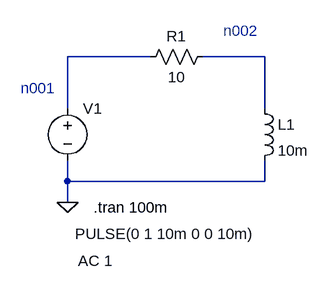
[diagram p0: schematic Yoneda-p70_Coil.asc]
Yoneda-p70_Coil.asc, the LTspice schematic file:
Version 4
SHEET 1 880 680
WIRE 224 32 96 32
WIRE 400 32 304 32
WIRE 96 112 96 32
WIRE 400 112 400 32
WIRE 96 224 96 192
WIRE 400 224 400 192
WIRE 400 224 96 224
WIRE 96 256 96 224
FLAG 96 256 0
SYMBOL voltage 96 96 R0
WINDOW 3 12 209 Left 2
WINDOW 123 16 250 Left 2
WINDOW 39 0 0 Left 2
SYMATTR InstName V1
SYMATTR Value PULSE(0 1 10m 0 0 10m)
SYMATTR Value2 AC 1
SYMBOL res 208 48 R270
WINDOW 0 32 56 VTop 2
WINDOW 3 0 56 VBottom 2
SYMATTR InstName R1
SYMATTR Value 10
SYMBOL ind 384 96 R0
SYMATTR InstName L1
SYMATTR Value 10m
TEXT 136 264 Left 2 !.tran 100m
TEXT 24 80 Left 2 ;n001
TEXT 336 -8 Left 2 ;n002

The netlist it stands for:
* Yoneda-p70_Coil.asc
V1 N001 0 PULSE(0 1 10m 0 0 10m) AC 1
R1 N001 N002 10
L1 N002 0 10m
.tran 100m
* n001
* n002
.backanno
.end